# Altium schematic sheet EvoProject 2.0.SchDoc
size A3
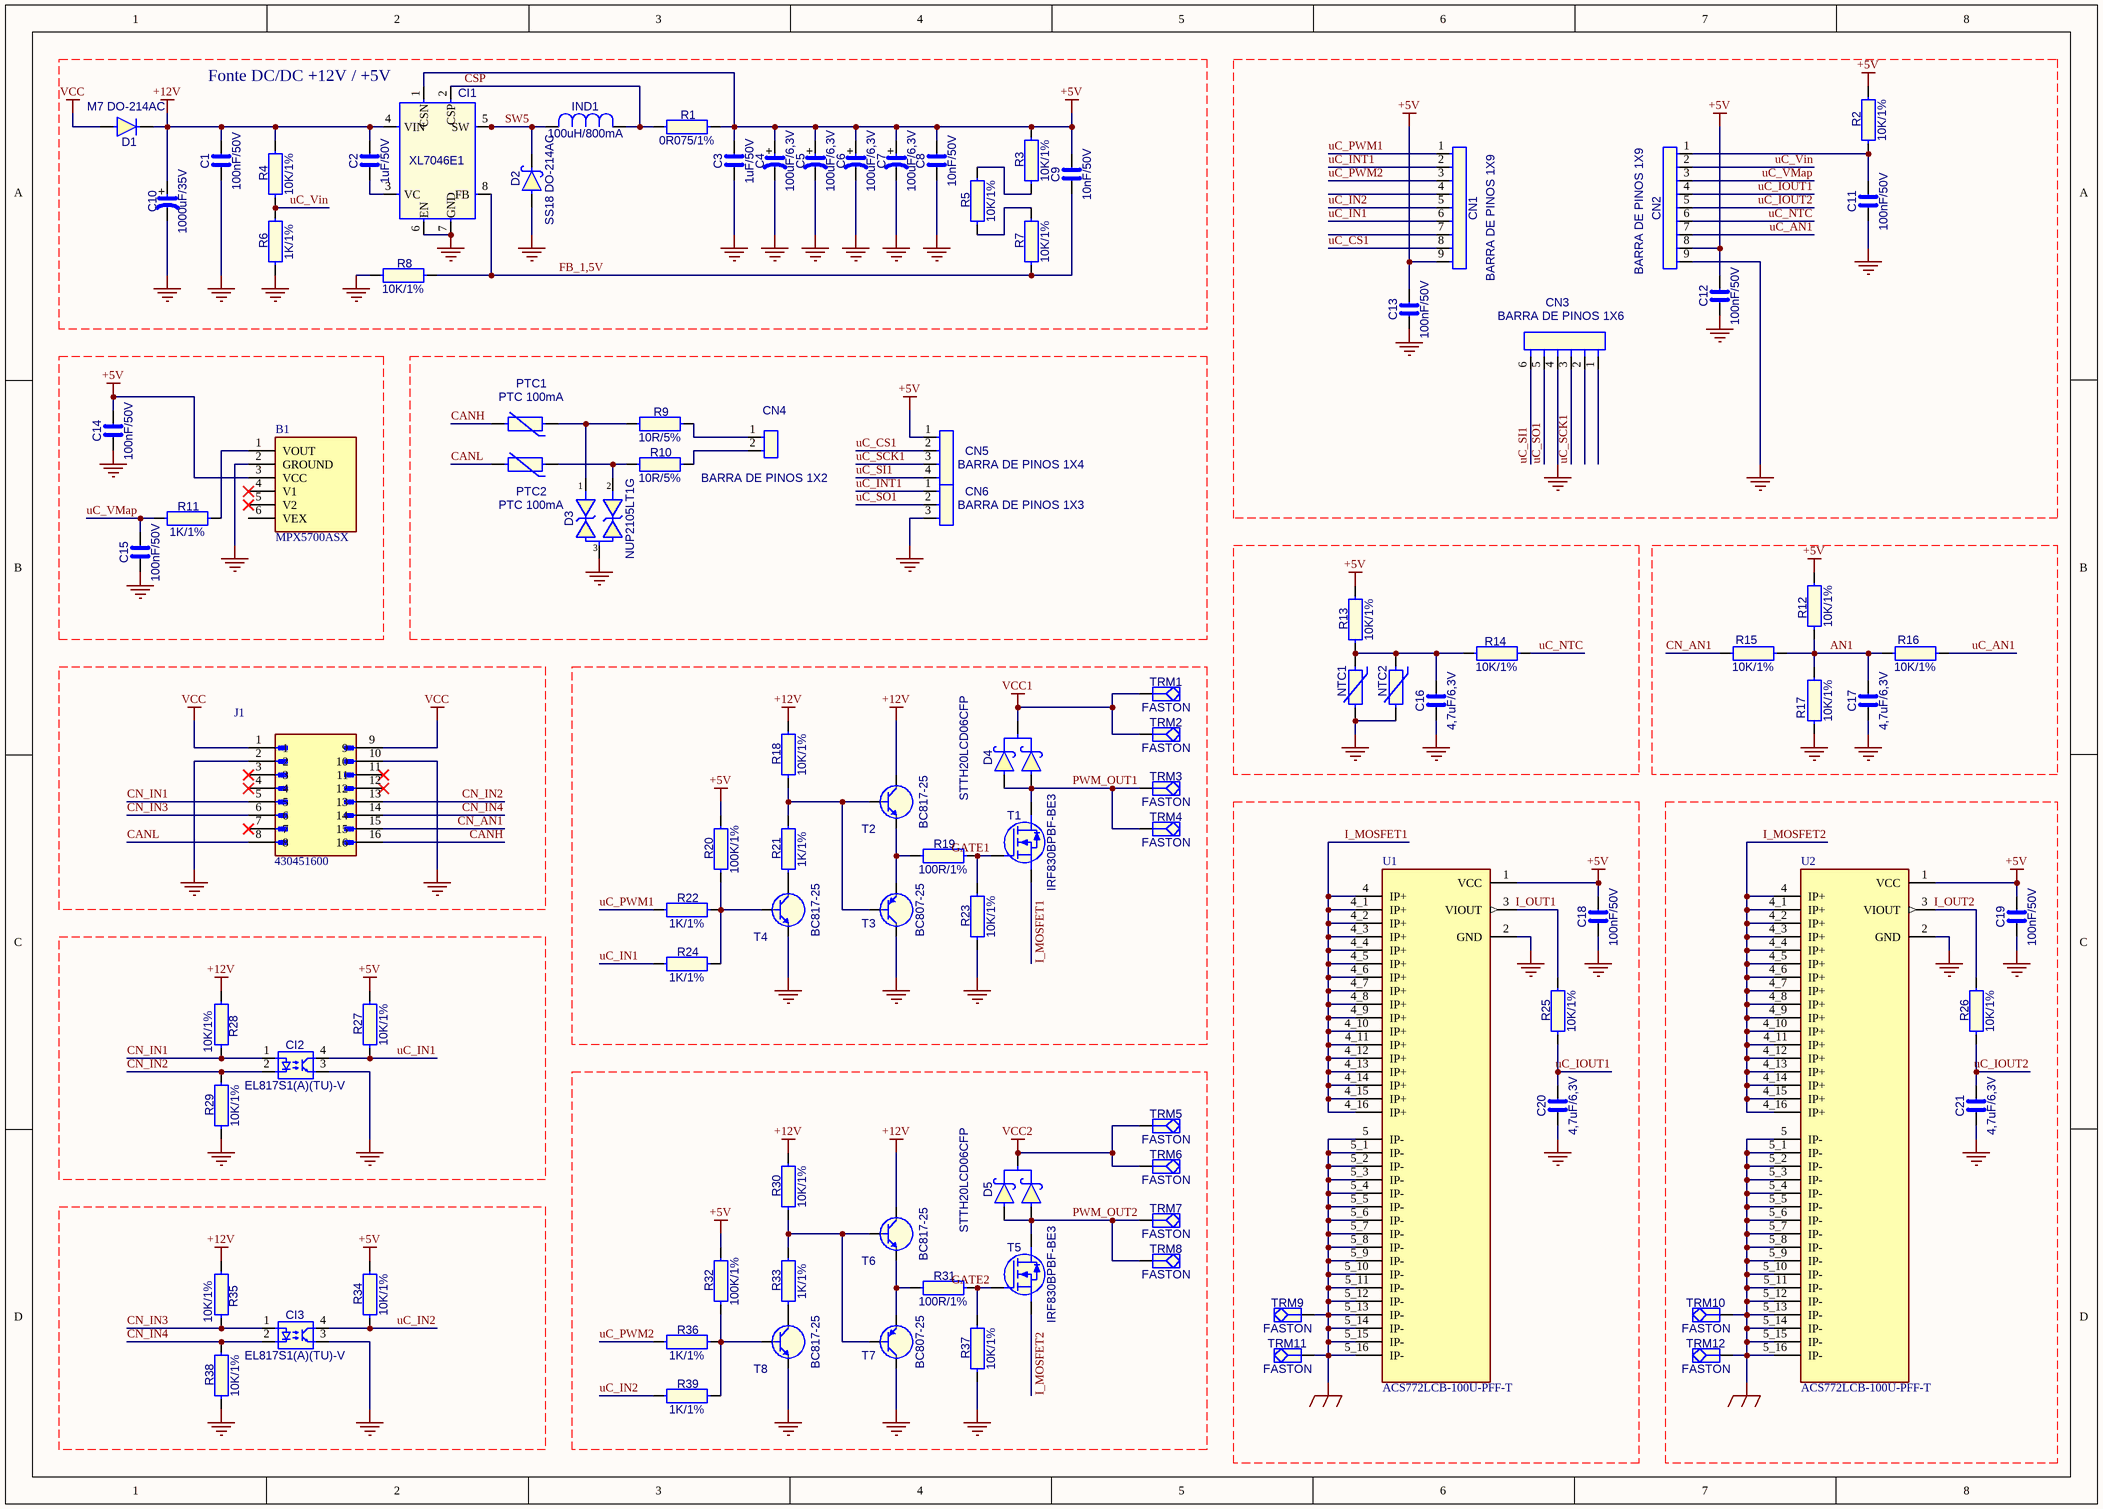
[diagram p0: EvoProject 2.0.SchDoc]

## Parts
B1  MPX5700ASX  [MPX5700ASX]
C1  100nF/50V  [CAP SMD CE 0603 HR]
C2  1uF/50V  [CAP SMD CE 0603 HR]
C3  1uF/50V  [CAP SMD CE 0603 HR]
C4  100uF/6,3V  [CAP SMD EL D.6,30 H.5,40 P.4,80 HR]
C5  100uF/6,3V  [CAP SMD EL D.6,30 H.5,40 P.4,80 HR]
C6  100uF/6,3V  [CAP SMD EL D.6,30 H.5,40 P.4,80 HR]
C7  100uF/6,3V  [CAP SMD EL D.6,30 H.5,40 P.4,80 HR]
C8  10nF/50V  [CAP SMD CE 0603 HR]
C9  10nF/50V  [CAP SMD CE 0603 HR]
C10  1000uF/35V  [CAP PTH EL D.13,00 H.20,00 P.5,00 RD MW]
C11  100nF/50V  [CAP SMD CE 0603 HR]
C12  100nF/50V  [CAP SMD CE 0603 HR]
C13  100nF/50V  [CAP SMD CE 0603 HR]
C14  100nF/50V  [CAP SMD CE 0603 HR]
C15  100nF/50V  [CAP SMD CE 0603 HR]
C16  4,7uF/6,3V  [CAP SMD CE 0603 HR]
C17  4,7uF/6,3V  [CAP SMD CE 0603 HR]
C18  100nF/50V  [CAP SMD CE 0603 HR]
C19  100nF/50V  [CAP SMD CE 0603 HR]
C20  4,7uF/6,3V  [CAP SMD CE 0603 HR]
C21  4,7uF/6,3V  [CAP SMD CE 0603 HR]
CI1  XL7046E1  [GEN SMD SOIC8 TP P.1,27 MR]
CI2  EL817S1(A)(TU)-V  [GEN SMD SOIC4 P.1,27 MR]
CI3  EL817S1(A)(TU)-V  [GEN SMD SOIC4 P.1,27 MR]
CN1  BARRA DE PINOS 1X9  [CON PTH BAR P.2,54 1x9 180D MW]
CN2  BARRA DE PINOS 1X9  [CON PTH BAR P.2,54 1x9 180D MW]
CN3  BARRA DE PINOS 1X6  [CON PTH BAR  W. L. H. P.2,54mm 1x6 180D MW]
CN4  BARRA DE PINOS 1X2  [CON PTH BAR  W. L. H. P.02,54mm 1x2 180D MW]
CN5  BARRA DE PINOS 1X4  [CON PTH BAR  W. L. H. P.02,54mm 1x4 180D MW]
CN6  BARRA DE PINOS 1X3  [CON PTH BAR  W. L. H. P.2,54mm 1x3 180D MW]
D1  M7 DO-214AC  [DIO SMD SMA DO214AC MR]
D2  SS18 DO-214AC  [DIO SMD SMA DO214AC HR]
D3  NUP2105LT1G  [GEN SMD SOT23-3 TO-236AA MR]
D4  STTH20LCD06CFP  [GEN PTH TO-220AB P.2,54 LW]
D5  STTH20LCD06CFP  [GEN PTH TO-220AB P.2,54 LW]
IND1  100uH/800mA  [IND SMD L.6,30 P.4,82 MR]
J1  430451600  [MOLEX_430451600]
NTC1  MF52A103H3950(A2)  [RES PTH NTC RADIAL P.2,54 LW]  (value not drawn)
NTC2  NTC 10k  [RES SMD CH 0805 HR]  (value not drawn)
PTC1  PTC 100mA  [PTC SMD CH 0805 HR]
PTC2  PTC 100mA  [PTC SMD CH 0805 HR]
R1  0R075/1%  [RES SMD CH 1206 HR]
R2  10K/1%  [RES SMD CH 0603 HR]
R3  10K/1%  [RES SMD CH 0603 HR]
R4  10K/1%  [RES SMD CH 0603 HR]
R5  10K/1%  [RES SMD CH 0603 HR]
R6  1K/1%  [RES SMD CH 0603 HR]
R7  10K/1%  [RES SMD CH 0603 HR]
R8  10K/1%  [RES SMD CH 0603 HR]
R9  10R/5%  [RES SMD CH 0603 HR]
R10  10R/5%  [RES SMD CH 0603 HR]
R11  1K/1%  [RES SMD CH 0603 HR]
R12  10K/1%  [RES SMD CH 0603 HR]
R13  10K/1%  [RES SMD CH 0603 HR]
R14  10K/1%  [RES SMD CH 0603 HR]
R15  10K/1%  [RES SMD CH 0603 HR]
R16  10K/1%  [RES SMD CH 0603 HR]
R17  10K/1%  [RES SMD CH 0603 HR]
R18  10K/1%  [RES SMD CH 0603 HR]
R19  100R/1%  [RES SMD CH 0603 HR]
R20  100K/1%  [RES SMD CH 0603 HR]
R21  1K/1%  [RES SMD CH 0603 HR]
R22  1K/1%  [RES SMD CH 0603 HR]
R23  10K/1%  [RES SMD CH 0603 HR]
R24  1K/1%  [RES SMD CH 0603 HR]
R25  10K/1%  [RES SMD CH 0603 HR]
R26  10K/1%  [RES SMD CH 0603 HR]
R27  10K/1%  [RES SMD CH 0603 HR]
R28  10K/1%  [RES SMD CH 0603 HR]
R29  10K/1%  [RES SMD CH 0603 HR]
R30  10K/1%  [RES SMD CH 0603 HR]
R31  100R/1%  [RES SMD CH 0603 HR]
R32  100K/1%  [RES SMD CH 0603 HR]
R33  1K/1%  [RES SMD CH 0603 HR]
R34  10K/1%  [RES SMD CH 0603 HR]
R35  10K/1%  [RES SMD CH 0603 HR]
R36  1K/1%  [RES SMD CH 0603 HR]
R37  10K/1%  [RES SMD CH 0603 HR]
R38  10K/1%  [RES SMD CH 0603 HR]
R39  1K/1%  [RES SMD CH 0603 HR]
T1  IRF830BPBF-BE3  [GEN PTH TO-220AB P.2,54 LW]
T2  BC817-25  [GEN SMD SOT23-3 TO-236AA MR]
T3  BC807-25  [GEN SMD SOT23-3 TO-236AA MR]
T4  BC817-25  [GEN SMD SOT23-3 TO-236AA MR]
T5  IRF830BPBF-BE3  [GEN PTH TO-220AB P.2,54 LW]
T6  BC817-25  [GEN SMD SOT23-3 TO-236AA MR]
T7  BC807-25  [GEN SMD SOT23-3 TO-236AA MR]
T8  BC817-25  [GEN SMD SOT23-3 TO-236AA MR]
TRM1  FASTON  [Terminal Faston Macho 180° OBLONGO COM SUPORTE]
TRM2  FASTON  [Terminal Faston Macho 180° OBLONGO COM SUPORTE]
TRM3  FASTON  [Terminal Faston Macho 180° OBLONGO COM SUPORTE]
TRM4  FASTON  [Terminal Faston Macho 180° OBLONGO COM SUPORTE]
TRM5  FASTON  [Terminal Faston Macho 180° OBLONGO COM SUPORTE]
TRM6  FASTON  [Terminal Faston Macho 180° OBLONGO COM SUPORTE]
TRM7  FASTON  [Terminal Faston Macho 180° OBLONGO COM SUPORTE]
TRM8  FASTON  [Terminal Faston Macho 180° OBLONGO COM SUPORTE]
TRM9  FASTON  [Terminal Faston Macho 180° OBLONGO COM SUPORTE]
TRM10  FASTON  [Terminal Faston Macho 180° OBLONGO COM SUPORTE]
TRM11  FASTON  [Terminal Faston Macho 180° OBLONGO COM SUPORTE]
TRM12  FASTON  [Terminal Faston Macho 180° OBLONGO COM SUPORTE]
U1  ACS772LCB-100U-PFF-T  [XDCR_ACS772LCB-100U-PFF-T]
U2  ACS772LCB-100U-PFF-T  [XDCR_ACS772LCB-100U-PFF-T]

## Nets
+5V: B1.3(VCC) C3.1 C4.2(Plus) C5.2(Plus) C6.2(Plus) C7.2(Plus) C8.1 C9.1 C12.2 C13.2 C14.1 C18.1 C19.1 CI1.1(CSN) CN1.9 CN2.8 CN5.1 R1.2 R2.2 R3.2 R12.1 R13.2 R20.2 R27.2 R32.2 R34.2 U1.1(VCC) U2.1(VCC)
+12V: C1.1 C2.1 C10.2(Plus) CI1.4(VIN) D1.1(K) R4.2 R18.2 R28.1 R30.2 R35.1 T2.3(C) T6.3(C)
GND: B1.2(GROUND) C1.2 C3.2 C4.1(Minus) C5.1(Minus) C6.1(Minus) C7.1(Minus) C8.2 C10.1(Minus) C11.2 C12.1 C13.1 C14.2 C15.2 C16.2 C17.2 C18.2 C19.2 C20.2 C21.2 CI1.6(EN) CI1.7(GND) CI2.3(E) CI3.3(E) CN2.9 CN3.4 CN6.3 D2.2(A) D3.3 J1.2 J1.10 NTC1.1 NTC2.1 R6.1 R8.1 R17.2 R23.1 R29.1 R37.1 R38.1 T3.3(C) T4.2(E) T7.3(C) T8.2(E) U1.2(GND) U2.2(GND)
power_GND1: TRM9.1 TRM11.1 U1.5(IP-) U1.5_1(IP-) U1.5_2(IP-) U1.5_3(IP-) U1.5_4(IP-) U1.5_5(IP-) U1.5_6(IP-) U1.5_7(IP-) U1.5_8(IP-) U1.5_9(IP-) U1.5_10(IP-) U1.5_11(IP-) U1.5_12(IP-) U1.5_13(IP-) U1.5_14(IP-) U1.5_15(IP-) U1.5_16(IP-)
power_GND2: TRM10.1 TRM12.1 U2.5(IP-) U2.5_1(IP-) U2.5_2(IP-) U2.5_3(IP-) U2.5_4(IP-) U2.5_5(IP-) U2.5_6(IP-) U2.5_7(IP-) U2.5_8(IP-) U2.5_9(IP-) U2.5_10(IP-) U2.5_11(IP-) U2.5_12(IP-) U2.5_13(IP-) U2.5_14(IP-) U2.5_15(IP-) U2.5_16(IP-)
VCC: D1.2(A) J1.1 J1.9
VCC1: D4.2(K) TRM1.1 TRM2.1
VCC2: D5.2(K) TRM5.1 TRM6.1
AN1: C17.1 R12.2 R15.1 R16.2 R17.1
CANH: J1.16 PTC1.1
CANL: J1.8 PTC2.1
CN_AN1: J1.15 R15.2
CN_IN1: CI2.1(A) J1.5 R28.2
CN_IN2: CI2.2(K) J1.13 R29.2
CN_IN3: CI3.1(A) J1.6 R35.2
CN_IN4: CI3.2(K) J1.14 R38.2
CSP: CI1.2(CSP) IND1.2 R1.1
FB_1,5V: C9.2 CI1.8(FB) R7.1 R8.2
GATE1: R19.2 R23.2 T1.1(G)
GATE2: R31.2 R37.2 T5.1(G)
I_MOSFET1: T1.3(S) U1.4(IP+) U1.4_1(IP+) U1.4_2(IP+) U1.4_3(IP+) U1.4_4(IP+) U1.4_5(IP+) U1.4_6(IP+) U1.4_7(IP+) U1.4_8(IP+) U1.4_9(IP+) U1.4_10(IP+) U1.4_11(IP+) U1.4_12(IP+) U1.4_13(IP+) U1.4_14(IP+) U1.4_15(IP+) U1.4_16(IP+)
I_MOSFET2: T5.3(S) U2.4(IP+) U2.4_1(IP+) U2.4_2(IP+) U2.4_3(IP+) U2.4_4(IP+) U2.4_5(IP+) U2.4_6(IP+) U2.4_7(IP+) U2.4_8(IP+) U2.4_9(IP+) U2.4_10(IP+) U2.4_11(IP+) U2.4_12(IP+) U2.4_13(IP+) U2.4_14(IP+) U2.4_15(IP+) U2.4_16(IP+)
I_OUT1: R25.2 U1.3(VIOUT)
I_OUT2: R26.2 U2.3(VIOUT)
PWM_OUT1: D4.1(A1) D4.3(A2) T1.2(D) TRM3.1 TRM4.1
PWM_OUT2: D5.1(A1) D5.3(A2) T5.2(D) TRM7.1 TRM8.1
SW5: CI1.5(SW) CI1.9(TAB) D2.1(K) IND1.1
uC_AN1: CN2.7 R16.1
uC_CS1: CN1.8 CN5.2
uC_IN1: CI2.4(C) CN1.6 R24.1 R27.1
uC_IN2: CI3.4(C) CN1.5 R34.1 R39.1
uC_INT1: CN1.2 CN6.1
uC_IOUT1: C20.1 CN2.4 R25.1
uC_IOUT2: C21.1 CN2.5 R26.1
uC_NTC: CN2.6 R14.1
uC_PWM1: CN1.1 R22.1
uC_PWM2: CN1.3 R36.1
uC_SCK1: CN3.3 CN5.3
uC_SI1: CN3.6 CN5.4
uC_SO1: CN3.5 CN6.2
uC_Vin: CN2.2 R4.1 R6.2
uC_VMap: C15.1 CN2.3 R11.1
NetB1_1: B1.1(VOUT) R11.2
NetC2_2: C2.2 CI1.3(VC)
NetC11_1: C11.1 CN2.1 R2.1
NetC16_1: C16.1 NTC1.2 NTC2.2 R13.1 R14.2
NetCN4_1: CN4.1 R9.2
NetCN4_2: CN4.2 R10.2
NetD3_1: D3.1 PTC1.2 R9.1
NetD3_2: D3.2 PTC2.2 R10.1
NetR3_1: R3.1 R5.2
NetR5_1: R5.1 R7.2
NetR18_1: R18.1 R21.2 T2.1(B) T3.1(B)
NetR19_1: R19.1 T2.2(E) T3.2(E)
NetR20_1: R20.1 R22.2 R24.2 T4.1(B)
NetR21_1: R21.1 T4.3(C)
NetR30_1: R30.1 R33.2 T6.1(B) T7.1(B)
NetR31_1: R31.1 T6.2(E) T7.2(E)
NetR32_1: R32.1 R36.2 R39.2 T8.1(B)
NetR33_1: R33.1 T8.3(C)

Not connected (* = marked no-connect by the designer): B1 4(V1)* 5(V2)* 6(VEX); CN1 4 7; CN3 1 2; J1 3* 4* 7* 11* 12*

## Notes on the sheet
- (near CI1) Fonte DC/DC +12V / +5V
- Modelo:
- Formato:
- Criado:
- A3
- Responsável:
- Alterado:
- Revisão:
- Página:
- de
- Arquivo:
- Versão:
- (in symbol CMPL-001-0020-14) +
- (in symbol CMPL-001-0047-7) +

## Library data of the parts
C1 C11-C15 C18 C19 = CMPL-001-0040-11: CAPACITOR SMD CE 0603 100nF 50V 10% X7R; Manufacturer 1: SAMSUNG; Part Number 1: CL10B104KB8NNNC; ERP: 5845; Supplier 1: FUTURE ELECTRONICS CORP.; HC 1: N/A; Supplier 2: AVNET ELECTRONICS MARKETING; Montagem: SMD; Package: N/A; HC 2: N/A; Status: 1 - LIBERADO; Manufacturer 2: SAMSUNG ELECTRONICS; Part Number 2: CL10B104KB8NNNC
C2 C3 = CMPL-001-0071-10: CAPACITOR SMD CE 0603 1uF 50V 10% X5R; Part Number 1: CL10A105KB8NNNC; Manufacturer 1: SAMSUNG; ERP: 5855; Part Number 2: UMK107BJ105KA-T; HC 2: N/A; Supplier 1: FUTURE ELECTRONICS CORP.; Manufacturer 2: TAIYO YUDEN; Footprint Path: PCBLibrary.PcbLib; Footprint Ref 2: CAP SMD CE 0603 MR; Montagem: SMD; Package: N/A; HC 1: N/A; Footprint Ref: CAP SMD CE 0603 HR; Supplier 2: K-1 TECHNOLOGIES INC; Library Ref: CAP_NP; Library Path: SchLibrary.SchLib
C4-C7 = CMPL-001-0047-7: CAPACITOR SMD EL D.6.3 H.5.4mm 100uF 6.3V 20% BESR; Part Number 1: LZ-101-M-006-TX-XX-X-0654-V00; Manufacturer 1: ENW; ERP: 5896; Footprint Ref 2: CAP SMD EL D.6,30 H.5,40 P.4,80 MR; HC 2: N/A; Supplier 1: JYE FWE ELECTRONICS COMPANY LIMITED; HC 1: N/A; Montagem: SMD; Supplier 2: N/A; Part Number 2: N/A; Library Path: SchLibrary.SchLib; Manufacturer 2: N/A; Package: N/A; Footprint Ref: CAP SMD EL D.6,30 H.5,40 P.4,80 HR; Library Ref: CAP_P; Footprint Path: PCBLibrary.PcbLib
C8 C9 = CMPL-001-0052-11: CAPACITOR SMD CE 0603 10nF 50V 20% X7R; Part Number 1: CL10B103KB8NNNC; Manufacturer 1: SAMSUNG; ERP: 5850; Supplier 1: ARROW COMPONENTS MEXICO S.A. DE C.V.; Status: 1 - LIBERADO; Montagem: SMD; HC 2: N/A; Package: N/A; Part Number 2: CL10B103KB8NNNC; HC 1: N/A; Manufacturer 2: SAMSUNG; Supplier 2: ARROW ELECTRONICS,INC.
C10 = CMPL-001-0020-14: CAPACITOR PTH EL 1000/35 20%; Manufacturer 1: ENW; Part Number 1: GC-102-M-035-T2-A0-X-1321-V00; ERP: 5799; Pre-formagem: 24030; Custo médio (R$): 0.2438; Status: 1 - LIBERADO; Custo padrão (R$): 0.2438; Supplier 1: JYE FWE ELECTRONICS COMPANY LIMITED; Montagem: PTH
C16 C17 C20 C21 = CMPL-001-0121-11: CAPACITOR SMD CE 0603 4,7uF 6.3V 10% X5R; Manufacturer 1: SAMSUNG; Part Number 1: CL10A475KQ8NNNC; Custo padrão (R$): 0.4575; ERP: 9994; Supplier 1: FUTURE ELECTRONICS CORP.; Package: N/A; Supplier 2: DIGI-KEY CORPORATION; Manufacturer 2: SAMSUNG; Status: 1 - LIBERADO; Datasheet 2: L:\imagens\9994-1.jpg; HC 1: N/A; Part Number 2: CL10A475KQ8NNNC; Custo médio (R$): 0.4575; Datasheet 1: https://octopart.com/pt/datasheet/cl10a475kq8nnnc-samsung-10525435; HC 2: N/A; Montagem: SMD
CI1 = CMPL-001-0760-1: CI SMD REBAIXADOR DE TENSÃO XL7046E1; Manufacturer 1: XL SEMI; ERP: 12532; HC 2: N/A; Supplier 1: WUXI DONGHAI INTELLIGENT CONTROL COMPANY LTD; Part Number 2: N/A; Part Number 1: XL7046E1; Supplier 2: N/A; HC 1: N/A; Package: N/A; Manufacturer 2: N/A
CI2 CI3 = CMPL-001-0739-2: CI OPTOACOPLADOR SMD DIP-4 1CH 817 70V 80~160%; Manufacturer 1: Everlight; Custo padrão (R$): 0,2019; ERP: 6631; Custo médio (R$): 0,22948; Datasheet 2: L:\imagens\8717-4.jpg; Datasheet 1: N/A; Supplier 1: BLACK BEAR INTERNATIONAL LTD.; Package: N/A; Manufacturer 2: EVERLIGHT ELECTRONICS; Part Number 2: EL817S1(A)(TU); Part Number 1: EL817S1(A)(TU)-V; HC 1: N/A; Supplier 2: KENDALL SOURCE INC; HC 2: N/A; Montagem: SMD
CN1 CN2 = CMPL-001-1164-2: BARRA DE PINOS 180° RETOS (CORTAR 9 PINOS); ERP: 24107; Montagem: PTH
CN3 = CMPL-001-1325-5: CONECTOR BARRA DE PINOS 180° 1X6; Montagem: PTH; ERP: 6047
CN4 = CMPL-001-0133-6: BARRA DE PINOS 180° RETOS (CORTAR 2 PINOS); ERP: 24109; Montagem: PTH
CN5 = CMPL-001-0186-5: BARRA DE PINOS 180° RETOS (CORTAR 4 PINOS); ERP: 24106; Montagem: PTH
CN6 = CMPL-001-0181-5: BARRA DE PINOS 180° RETOS (CORTAR 3 PINOS); ERP: 24110; Montagem: PTH
D1 = CMPL-001-0897-1: DIODO SMD 1N4007 SMA; Manufacturer 1: HOTTECH; ERP: 3583; HC 1: N/A; HC 2: N/A; Manufacturer 2: LGE; Package: N/A; Part Number 1: M7 DO-214AC; Part Number 2: M7 SMA; Supplier 1: HOTTECH SEMICONDUCTOR TECHNOLOGY (HK) LTDA; Supplier 2: NEW TECK EXPORTADORA E IMPORTADORA LTDA
D2 = CMPL-001-0153-5: DIODO SMD SS18 1A 80V SCHOTTKY; Manufacturer 1: HOTTECH; ERP: 3589; Part Number 1: SS18 DO-214AC; Part Number 2: SS18; Manufacturer 2: YANGZHOU YANGJIE ELETRONICS
D3 = CMPL-001-0901-4: DIODO SMD TVS SOT23 24V 50A 350W; Manufacturer 1: ON SEMICONDUCTOR; ERP: 6620; Manufacturer 2: N/A; HC 2: N/A; HC 1: https://docs.inova.ind.br:8443/go.jsp?to=_bll4cld1MTZGV2taVWE1Z2xRVFM3QUthcmo5eGNTUHNuTXhCUXU0R0RGRW5OdEh3YzI0TXF2eVQycmhPUXBERnBOenE2T3E4Z25BcHM1USsybEI2cVE9PQ==; Supplier 2: N/A; Supplier 1: FUTURE ELECTRONICS CORP.; Part Number 1: NUP2105LT1G; Package: N/A; Part Number 2: N/A
D4 D5 = CMPL-001-1166-1: DIODO PTH STTH20LCD06CFP ULTRAFAST (PF07-6.5-V); ERP Original: 3622; ERP: 23945; Montagem: PTH
IND1 = CMPL-001-0162-3: INDUTOR SMD 100uH 800mA; Manufacturer 1: NIC COMPONENTS; Part Number 1: NPIS65LS101MTRF; ERP: 3734; Manufacturer 2: LAIRD-SIGNAL; Part Number 2: TYS6045101M-10; Supplier 1: HOTTECH SEMICONDUCTOR TECHNOL
J1 = 430451600: Conn Wire to Board HDR 16 POS 3mm Solder RA Side Entry Thru-Hole Micro-Fit 3.0â„¢ Tray; MF: Molex; SnapEDA_Link: https://www.snapeda.com/parts/430451600/Molex/view-part/?ref=snap; Package: None; Value: *; MP: 430451600
NTC1 = CMPL-001-1025-2: TERMISTOR NTC 10K (PF); Manufacturer 1: NANJING SHIHENG; ERP: 16217; Custo padrão (R$): 11,3383; Montagem: PTH; Custo médio (R$): 11,0249; Supplier 1: NANJING SHIHENG ELECTRONICS CO.,LTD.; Part Number 2: N/A; Datasheet 1: N/A; HC 1: N/A; Supplier 2: N/A; Package: N/A; Manufacturer 2: N/A; HC 2: N/A; Part Number 1: MF52A103H3950(A2); Datasheet 2: N/A
NTC2 = CMPL-001-0442-4: TERMISTOR SMD NTC 0805 10K BETA 3970 3%; Manufacturer 1: NANJING SHIHENG; Part Number 1: CMFB3970G103HNT; ERP: 3694; Montagem: SMD
PTC1 PTC2 = CMPL-001-0432-3: TERMISTOR SMD PTC 0805 0,1A 24V NHC; ERP: 20004
R1 = CMPL-001-0290-5: RESISTOR SMD CH 1206 0R075 1% 1/4W; Manufacturer 1: HOTTECH; Part Number 1: RI1206LR075FT; ERP: 4400; HC 2: N/A; Supplier 1: HOTTECH SEMICONDUCTOR TECHNOLOGY (HK) LTDA; Manufacturer 2: ROYAL ELETRONICS; Supplier 2: ROYAL ELETRONIC FACTORY(THAILAND)CO.,LTD; HC 1: N/A; Part Number 2: CS06W4F750MT5E; Package: N/A
R2-R5 R7 R8 R12-R18 R23 R25-R30 R34 R35 R37 R38 = CMPL-001-0308-5: RESISTOR SMD CH 0603 10K 1% 1/10W; Part Number 1: RI0603L1002FT; Manufacturer 1: HOTTECH; ERP: 4426; Part Number 2: RC0603FR-0710KL; Supplier 1: HOTTECH SEMICONDUCTOR TECHNOLOGY (HK) LTDA; Package: N/A; Supplier 2: SOLUCAO COMERCIO DE COMP ELE LTDA EPP; HC 2: N/A; HC 1: N/A; Manufacturer 2: YAGEO
R6 R11 R21 R22 R24 R33 R36 R39 = CMPL-001-0339-5: RESISTOR SMD CH 0603 1K 1% 1/10W; Manufacturer 1: HOTTECH; Part Number 1: RI0603L1001FT; ERP: 4459; Package: N/A; HC 1: N/A; Supplier 1: HOTTECH SEMICONDUCTOR TECHNOLOGY (HK) LTDA; Part Number 2: RC0603FR-071KL; Manufacturer 2: YAGEO; HC 2: N/A; Supplier 2: SOLUCAO COMERCIO DE COMP ELE LTDA EPP
R9 R10 = CMPL-001-0309-4: RESISTOR SMD CH 0603 10R 5% 1/10W; Manufacturer 1: HOTTECH; Part Number 1: RI0603L100JT; ERP: 4427; HC 1: N/A; Part Number 2: 0603WAJ0100T5E; Supplier 1: HOTTECH SEMICONDUCTOR TECHNOLOGY (HK) LTDA; Package: N/A; HC 2: N/A; Supplier 2: ROYAL ELETRONIC FACTORY(THAILAND)CO.,LTD; Manufacturer 2: ROYAL ELETRONICS
R19 R31 = CMPL-001-0411-4: RESISTOR SMD CH 0603 100R 1% 1/10W; Manufacturer 1: HOTTECH; Part Number 1: RI0603L1000FT; ERP: 9984; Manufacturer 2: ROYALOHM; Supplier 2: WKS TECHNOLOGY DO BRASIL LTDA; Part Number 2: 0603WAF1000T5E; HC 2: N/A; Package: N/A; HC 1: N/A; Supplier 1: HOTTECH SEMICONDUCTOR TECHNOLOGY (HK) LTDA
R20 R32 = CMPL-001-0354-5: RESISTOR SMD CH 0603 100K 1% 1/10W; Part Number 1: RI0603L1003FT; Manufacturer 1: HOTTECH; ERP: 4486; Supplier 2: N/A; Manufacturer 2: N/A; Part Number 2: N/A; Package: N/A; Supplier 1: HOTTECH SEMICONDUCTOR TECHNOLOGY (HK) LTDA; HC 1: N/A; HC 2: N/A
T1 T5 = CMPL-001-0476-4: TRANSISTOR PTH MOSFET IRF830BPBF-BE3 500V, 5,5A @ 25C°; ERP: 21476; Etapa: PTH
T2 T4 T6 T8 = CMPL-001-0444-6: TRANSISTOR SMD 817/25; Manufacturer 1: NEXPERIA (NXP); ERP: 5923; Custo médio (R$): 0.03943; Custo padrão (R$): 0.0344; Datasheet 1: N/A; Datasheet 2: N/A; HC 1: N/A; HC 2: N/A; Manufacturer 2: N/A; Package: N/A; Part Number 1: BC817-25; Part Number 2: N/A; Supplier 1: FUTURE ELECTRONICS CORP.; Supplier 2: N/A
T3 T7 = CMPL-001-0445-7: TRANSISTOR SMD 807/25; Manufacturer 1: NEXPERIA (NXP); ERP: 5924; Custo médio (R$): 0.03768; Custo padrão (R$): 0.0355; Datasheet 1: N/A; Datasheet 2: N/A; HC 1: N/A; HC 2: N/A; Manufacturer 2: N/A; Package: N/A; Part Number 1: BC807-25; Part Number 2: N/A; Supplier 1: FUTURE ELECTRONICS CORP.; Supplier 2: N/A
TRM1-TRM12 = CMPL-001-0475-2: TERMINAL P/ PCI 180° 6,35mmX14,2mm BAIONETA; ERP: 22116
U1 U2 = ACS772LCB-100U-PFF-T: Current Sensor 100A 1 Channel Hall Effect Unidirectional 5-CB Formed Leads, PFF; MF: Allegro MicroSystems LLC; SnapEDA_Link: https://www.snapeda.com/parts/ACS772LCB-100U-PFF-T/Allegro/view-part/?ref=snap; Package: 5-CB-5 Allegro MicroSystems LLC; Value: *; MP: ACS772LCB-100U-PFF-T